# Altium schematic sheet ASBB_Sonar.SchDoc
size A4
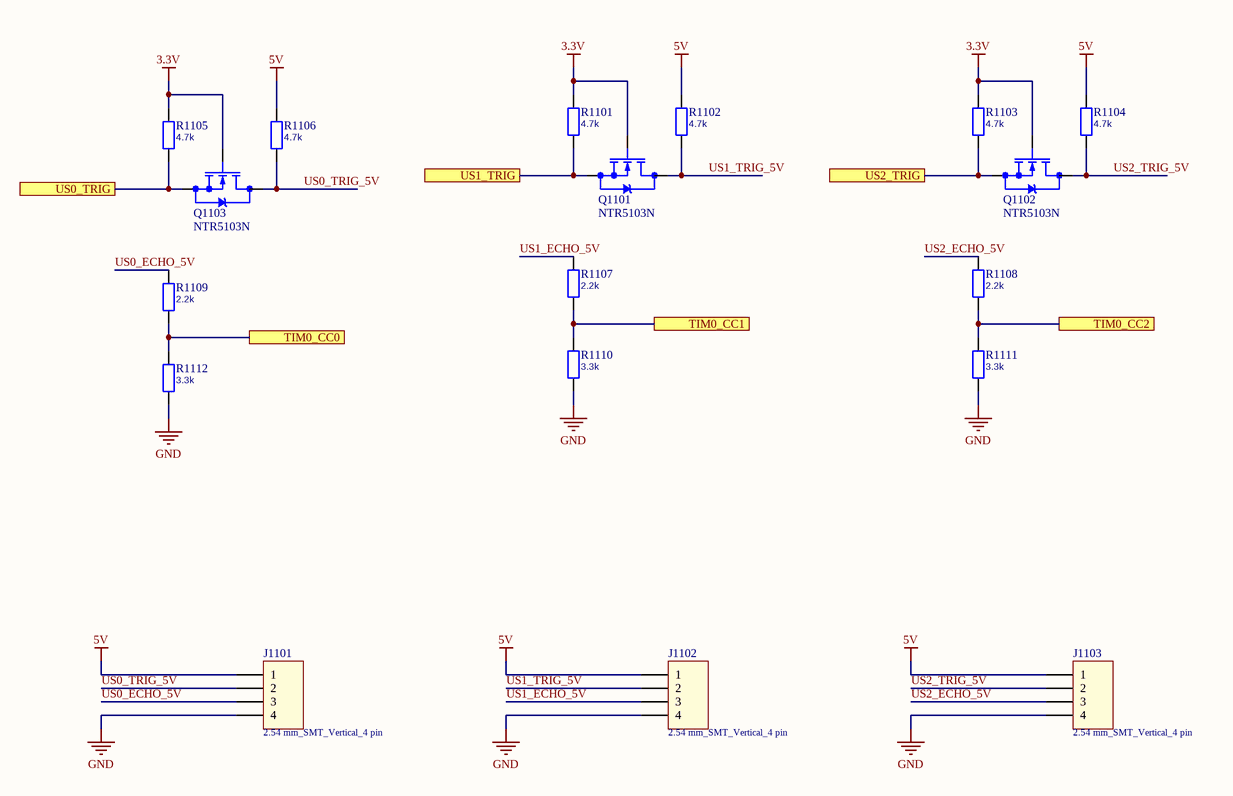
[diagram p0: ASBB_Sonar.SchDoc]

## Parts
J1101  2.54 mm_SMT_Vertical_4 pin  [61000411921]
J1102  2.54 mm_SMT_Vertical_4 pin  [61000411921]
J1103  2.54 mm_SMT_Vertical_4 pin  [61000411921]
Q1101  NTR5103N  [SOT23]
Q1102  NTR5103N  [SOT23]
Q1103  NTR5103N  [SOT23]
R1101  4.7k  [0603]
R1102  4.7k  [0603]
R1103  4.7k  [0603]
R1104  4.7k  [0603]
R1105  4.7k  [0603]
R1106  4.7k  [0603]
R1107  2.2k  [0603]
R1108  2.2k  [0603]
R1109  2.2k  [0603]
R1110  3.3k  [0603]
R1111  3.3k  [0603]
R1112  3.3k  [0603]

## Ports
TIM0_CC0, TIM0_CC1, TIM0_CC2, US0_TRIG, US1_TRIG, US2_TRIG

## Nets
3.3V: Q1101.1(G) Q1102.1(G) Q1103.1(G) R1101.2 R1103.2 R1105.2
5V: J1101.1 J1102.1 J1103.1 R1102.2 R1104.2 R1106.2
GND: J1101.4 J1102.4 J1103.4 R1110.1 R1111.1 R1112.1
TIM0_CC0: R1109.1 R1112.2 ; port TIM0_CC0
TIM0_CC1: R1107.1 R1110.2 ; port TIM0_CC1
TIM0_CC2: R1108.1 R1111.2 ; port TIM0_CC2
US0_ECHO_5V: J1101.3 R1109.2
US0_TRIG: Q1103.2(S) R1105.1 ; port US0_TRIG
US0_TRIG_5V: J1101.2 Q1103.3(D) R1106.1
US1_ECHO_5V: J1102.3 R1107.2
US1_TRIG: Q1101.2(S) R1101.1 ; port US1_TRIG
US1_TRIG_5V: J1102.2 Q1101.3(D) R1102.1
US2_ECHO_5V: J1103.3 R1108.2
US2_TRIG: Q1102.2(S) R1103.1 ; port US2_TRIG
US2_TRIG_5V: J1103.2 Q1102.3(D) R1104.1

## Library data of the parts
J1101-J1103 = 61000411921: Socket Header WR-PHD, Pitch 2.54 mm, SMT, Vertical, single row, 4 pin; Rated Current: 3 A; Pin Number: 4; Pitch: 2.54 mm; Working Voltage: 250 VAC; Contact Resistance: 20 mOhm; Insulation Resistance: >1000 MOhm; ComponentLink1Description: Manufacturer; ComponentLink1URL: http://www.we-online.de; ComponentLink2Description: Datasheet; ComponentLink2URL: http://katalog.we-online.com/em/datasheet/6100xx11921.pdf; Part Number: 61000411921; Published Date: Jan. 2018; Publisher: Wurth Elektronik; Operating Temperature: -40 to 125 degC; Mounting Technology: SMT; Row Number: single; Orientation: Vertical
Q1101-Q1103 = NMOS SOT23: N-Channel MOSFET SOT23; Value: ?; Partnumber: ?
R1101-R1112 = Resistor: Partnumber: ?; Value: ?